# Altium schematic sheet OpenBLC_LTC4412.SchDoc
size A
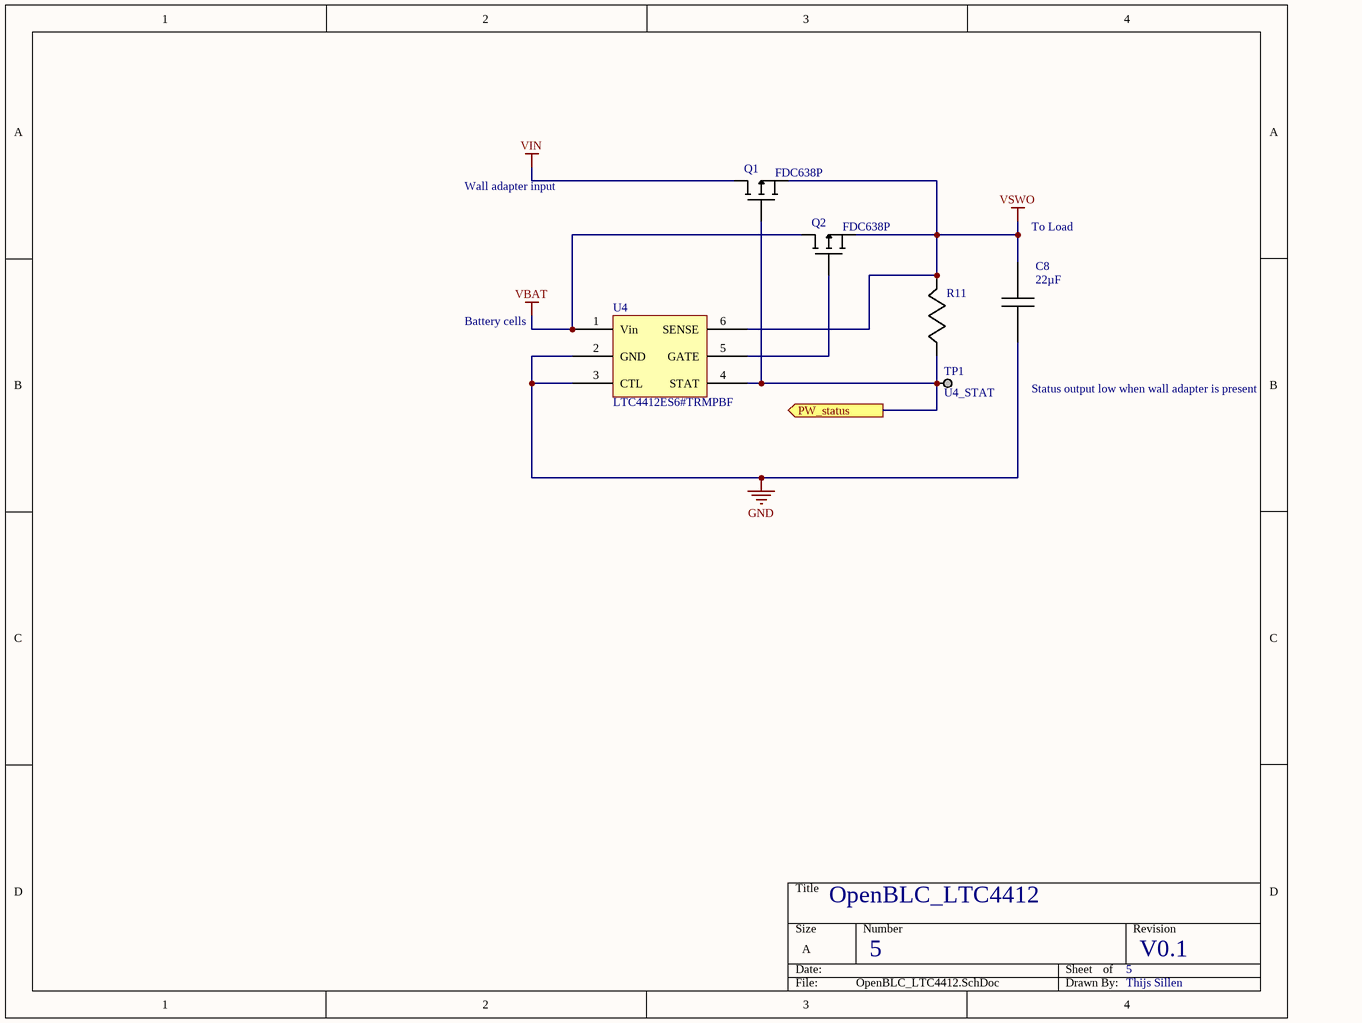
[diagram p0: OpenBLC_LTC4412.SchDoc]

## Parts
C8  Capacitance: 22µF  [0805_CAP]  (hidden comment: C2012X5R0J226M125AC)
Q1  FDC638P  [FDC638P]
Q2  FDC638P  [FDC638P]
R11  0805_RES  [0805_RES]  (value not drawn)
TP1  U4_STAT  [Via_TP]
U4  LTC4412ES6#TRMPBF  [SOT95P280X110-6N]

## Ports
PW_status (out)

## Nets
GND: C8.2 U4.2(GND) U4.3(CTL)
VBAT: Q2.1(D) U4.1(Vin)
VIN: Q1.1(D)
VSWO: C8.1 Q1.3(S) Q2.3(S) R11.1 U4.6(SENSE)
PW_status: Q1.2(G) R11.2 TP1.1 U4.4(STAT) ; port PW_status
NetQ2_2: Q2.2(G) U4.5(GATE)

## Notes on the sheet
- Wall adapter input
- (near C8) To Load
- Battery cells
- Status output low when wall adapter is present
- OpenBLC_LTC4412
- 5
- V0.1
- Thijs Sillen

## Library data of the parts
C8 = C2012X5R0J226M125AC: CAP CER 22UF 6.3V 20% X5R 0805; Manufacturer: TDK Corporation; Supplier 1: Digi-Key; Supplier Part Number 1: 445-1422-1-ND; RoHS: RoHS Compliant; Category: Capacitors; Stock 1: 147939; Pricing 1: 1=0.24, 10=0.204, 100=0.1021, 250=0.07656, 500=0.06762, 1000=0.05878 (EUR); Packaging: Cut Tape (CT); Tolerance: ±20%; Voltage - Rated: 6.3V; Temperature Coefficient: X5R; Mounting Type: Surface Mount, MLCC; Operating Temperature: -55°C ~ 85°C; Applications: General Purpose; Ratings: -; Package / Case: 0805 (2012 Metric); Size / Dimension: 0.079" L x 0.049" W (2.00mm x 1.25mm); Height - Seated (Max): -; Thickness (Max): 0.057" (1.45mm); Lead Spacing: -; Features: -; Lead Style: -; ComponentLink1URL: http://product.tdk.com/en/catalog/datasheets/mlcc_commercial_general_en.pdf; ComponentLink1Description: http://product.tdk.com/en/catalog/datasheets/mlcc_commercial_general_en.pdf; Manufacturer Part Number: C2012X5R0J226M125AC
Q1 Q2 = FDC638P: MOSFET SSOT-6 P-CH -20V; Manufacturer: Fairchild Semiconductor; Configuratie: Single Quad Drain; Verpakken: Reel; Voorwaartse transconductantie - min: 15 S; Montagetype: SMD/SMT; Polariteit transistor: P-Channel; Kanaalmodus: Enhancement; Daaltijd: 9 ns; Id - Continue afvoerstroom: 4.5 A; Maximale bedrijfstemperatuur: + 150 C; Minimale bedrijfstemperatuur: - 55 C; Pd - Vermogensverlies: 1.6 W; Rds On - Druppelbronweerstand: 48 mOhms; Standaard pakket hoeveelheid: 3000; Typische uitschakelvertragingstijd: 33 ns; Vgs - Doorslagspanning van ingangsbron: 12 V; Product Status: New Product; Supplier 1: Mouser; Supplier Part Number 1: 512-FDC638P; RoHS: RoHS Compliant; Category: MOSFET; Stock 1: 2304; Pricing 1: 1=0.400, 10=0.272, 100=0.180, 1000=0.139, 3000=0.117, 9000=0.113, 24000=0.107, 45000=0.105 (EUR); Verpakking / doos: SSOT-6; Reeks: FDC638P; Merk: Fairchild Semiconductor; Fabrikant: Fairchild Semiconductor; Stijgtijd: 9 ns; Vds - Doorslagspanning van druppelbron: - 20 V; RoHS - Mouser: Y; Minimum Order Quantity: 1; Reeling: True; ComponentLink1URL: http://www.mouser.com/ds/2/149/FDC638P-103274.pdf; ComponentLink1Description: http://www.mouser.com/ds/2/149/FDC638P-103274.pdf; Manufacturer Part Number: FDC638P
TP1 = TESTPOINT: TESTPOINT SCOPE GRABBER; Manufacturer Part Number: 5010; Manufacturer: Keystone Electronics; Reel: TH; Supplier 1: Digi-Key; Supplier Part Number 1: 5010K-ND
U4 = LTC4412ES6#TRMPBF: IC OR CTRLR SRC SELECT TSOT23-6; Manufacturer: Linear Technology; FET Type: P-Channel; Ratio - Input:Output: 2:1; Internal Switch(s): No; Delay Time - ON: 110µs; Delay Time - OFF: 13µs; Current - Supply: 15µA; Voltage - Supply: 2.5 V ~ 28 V; Supplier 1: Digi-Key; Supplier Part Number 1: LTC4412ES6#TRMPBFCT-ND; RoHS: RoHS Compliant; Category: Integrated Circuits (ICs); Stock 1: 19945; Pricing 1: 1=2.79, 25=2.4972, 100=2.2477 (EUR); Packaging: Cut Tape (CT); Type: Source Selector Switch; Current - Output (Max): -; Applications: Handheld/Mobile Devices; Operating Temperature: -40°C ~ 85°C; Mounting Type: Surface Mount; Package / Case: SOT-23-6 Thin, TSOT-23-6; Supplier Device Package: TSOT-23-6; ComponentLink1URL: http://www.linear.com/docs/1527; ComponentLink1Description: http://www.linear.com/docs/1527; Manufacturer Part Number: LTC4412ES6#TRMPBF